# EAGLE design RedBot_Line_Sensor (EAGLE 6.6.0)
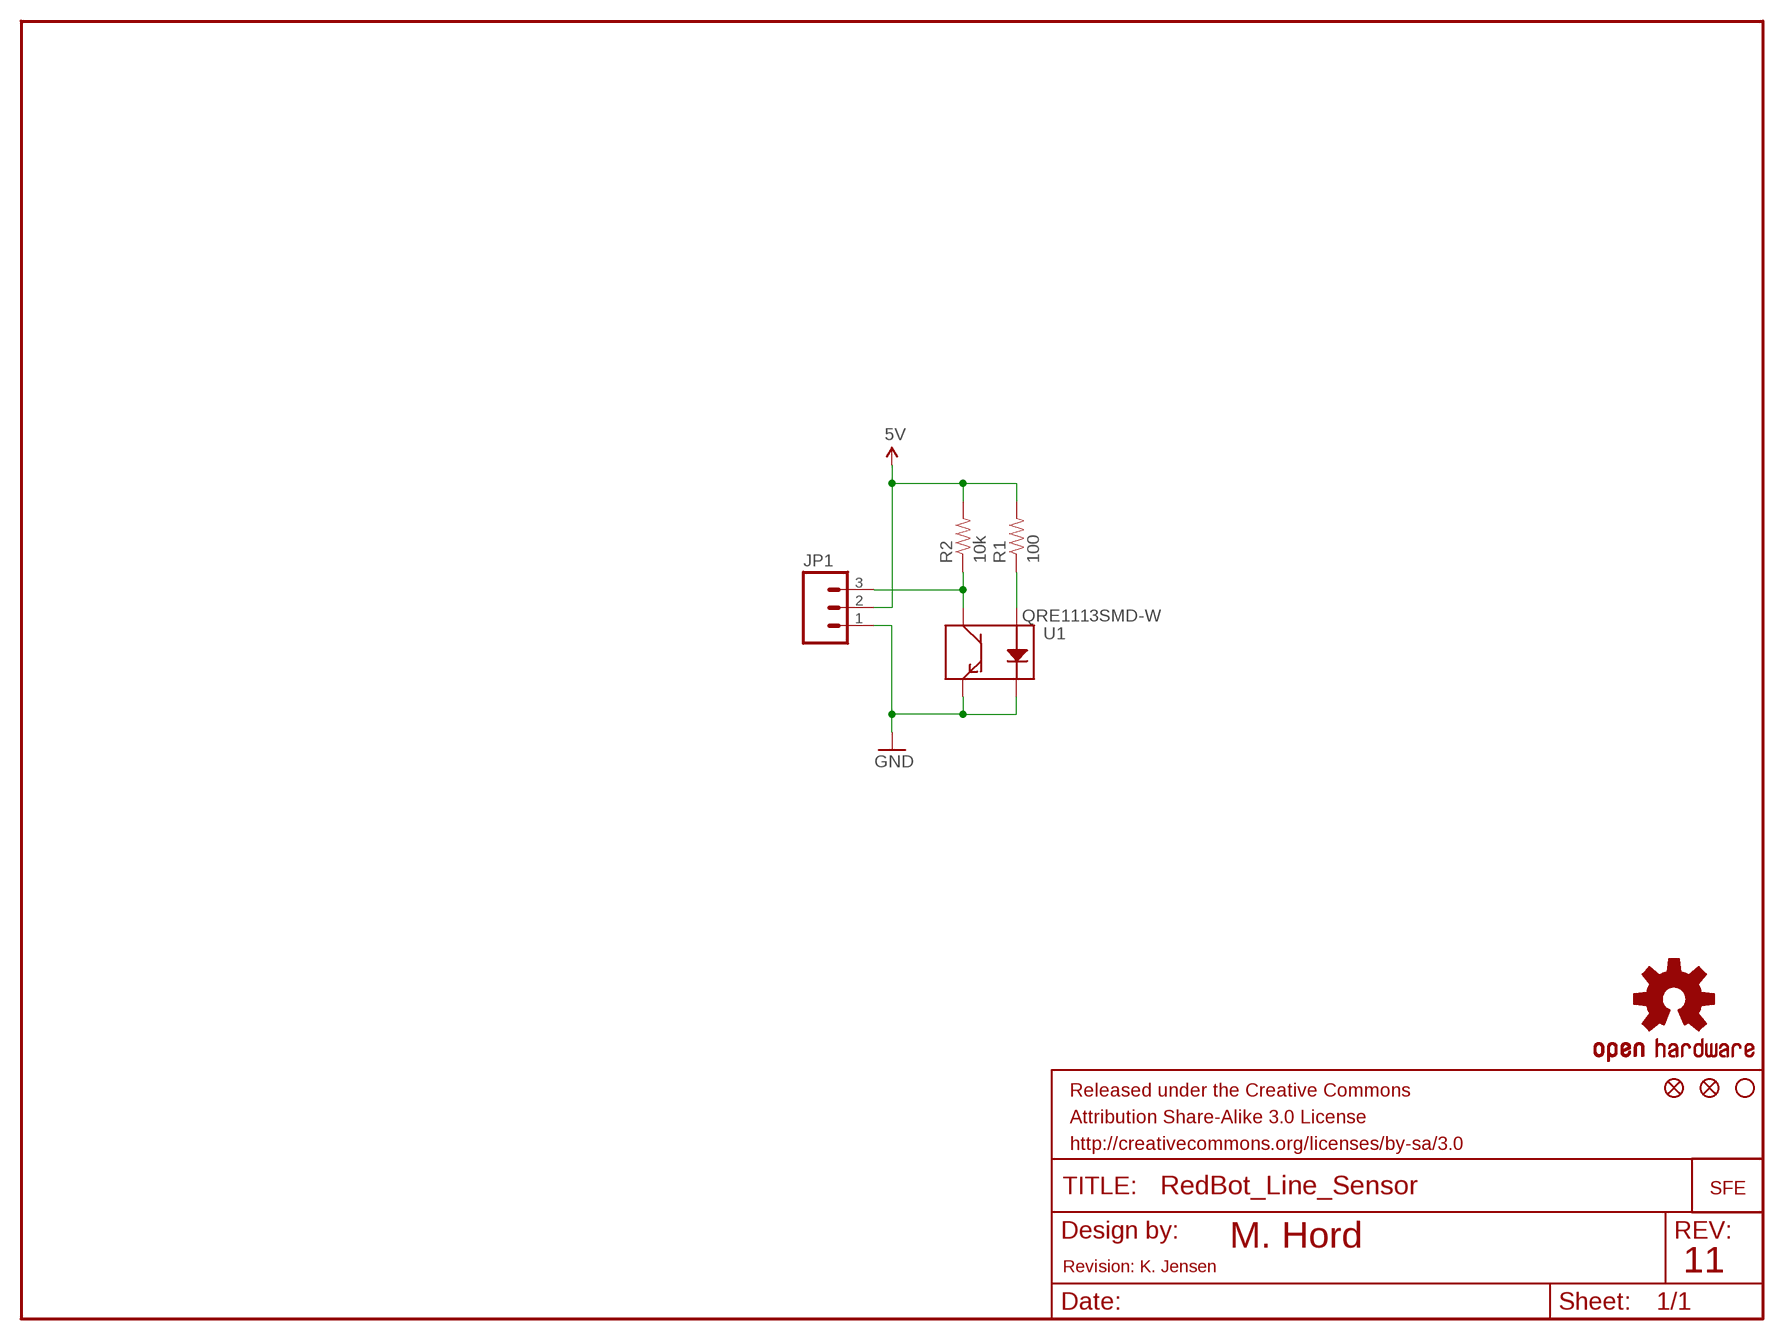
[diagram p0: schematic, sheet 1]

## Parts
FID1  FIDUCIAL1X2  [FIDUCIAL-1X2]
FID2  FIDUCIAL1X2  [FIDUCIAL-1X2]
FRAME1  FRAME-LETTER  [CREATIVE_COMMONS]
JP1  M031X03_SMD_RA_MALE_POST_SMALLER  [1X03_SMD_RA_MALE_POST_SMALLER]
LOGO2  OSHW-LOGOS  [OSHW-LOGO-S]
LOGO3  LOGO-SFESK  [SFE-LOGO-FLAME]
R1  100  100-1%  [0603-RES]
R2  10k  10KOHM1/10W1%(0603)0603  [0603-RES]
STANDOFF1  STAND-OFF  [STAND-OFF]
U1  QRE1113SMD-W  [QRE1113-W]

## Nets
5V: JP1.2 R1.2 R2.2
GND: JP1.1 U1.2(K) U1.4(E)
N$1: R1.1 U1.1(A)
N$2: JP1.3 R2.1 U1.3(C)

## Notes on the sheet
- M. Hord
- Revision: K. Jensen | 11

## Library data of the parts
FID1 FID2 = SparkFun-Aesthetics:FIDUCIAL: Fiducial Alignment Points Various fiducial points for machine vision alignment.
FRAME1 = SparkFun-Aesthetics:FRAME-LETTER: Schematic Frame Standard 8.5x11 US Letter frame
JP1 = SparkFun-Connectors:M03: Header 3 Standard 3-pin 0.1" header. Use with straight break away headers (SKU : PRT-00116), right angle break away headers (PRT-00553), swiss pins (PRT-00743), machine pins (PRT-00117), and female headers (PRT-00115). Molex polarized connector foot print use with SKU : PRT-08232 with associated crimp pins and housings.
LOGO2 = SparkFun-Aesthetics:OSHW-LOGO: Open Source Hardware Logo This logo indicates the piece of hardware it is found on incorporates a OSHW license and/or adheres to the definition of open source hardware found here: http://freedomdefined.org/OSHW
LOGO3 = SparkFun-Aesthetics:LOGO-SFE: Spark Fun Electronics PCB Logo This is the standard Spark Fun Electronics PCB logo.
R1 = SparkFun-Resistors:100-1%: 100-ohm SMT 1/10W - 1% (0603) RES-07863; PROD_ID: RES-07863
R2 = SparkFun-Resistors:10KOHM1/10W1%(0603): RES-00824; PROD_ID: RES-00824; VALUE: 10K
STANDOFF1 = SparkFun-Electromechanical:STAND-OFF: #4 Stand Off This is the mechanical footprint for a #4 phillips button head screw. Use the keepout ring to avoid running the screw head into surrounding components. SKU : PRT-00447
U1 = SparkFun-Sensors:QRE1113: Reflective object sensor

## Board
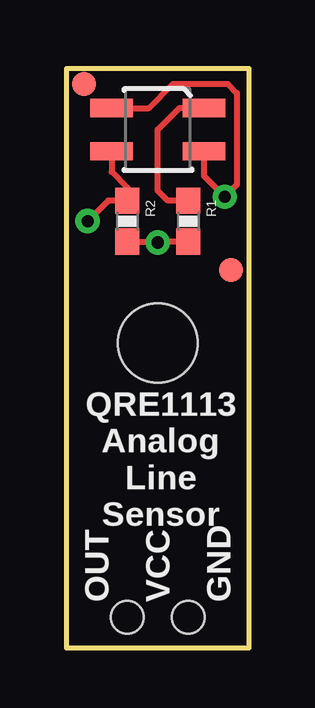
[diagram p1: board, top side]
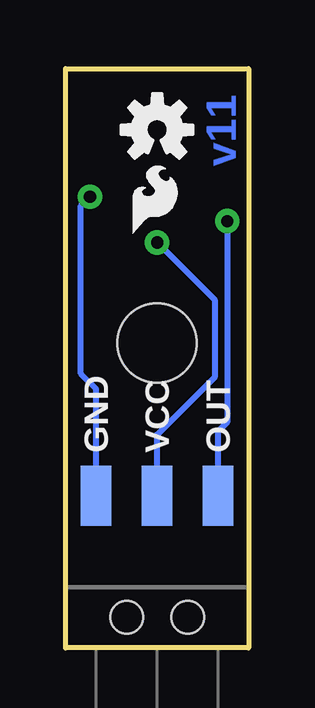
[diagram p2: board, bottom side, seen from below]

Size 7.62 x 24.13 mm. Coordinates in mm from the lower left corner, seen from the top.
Outline: 0,0 7.62,0 7.62,24.13 0,24.13 0,0
Copper layers (1*16): Top 0.035mm / dielectric 1.5mm / Bottom 0.035mm
Design rules "SparkFun-2-layer": minimum track width 7mil, minimum drill 15mil, track to track 8mil, track to pad 8mil, pad to pad 8mil, via to via 8mil, smd to smd 8mil, copper to edge 8mil, drill to drill 8mil, minimum pad ring 12mil, minimum via ring 10mil, stop-mask expansion 4mil, vias tented up to drill 20mil, thermal gap 10mil

### Footprints (pad centres in the part's own frame; a part is rotated, then mirrored left to right if it is on the bottom)
FIDUCIAL-1X2 = smd 1 x 1: 1 0,0
1X03_SMD_RA_MALE_POST_SMALLER = smd 1.27 x 2.5: 1 -2.54,5.07; 2 0,5.07; 3 2.54,5.07 | hole 1.359: -1.27,0; 1.27,0
0603-RES = smd 1.1 x 1: 1 -0.85,0; 2 0.85,0
STAND-OFF = hole 3.302: 0,0
QRE1113-W = smd 1.778 x 0.762: 1 -1.927,-0.9; 2 1.927,-0.9; 3 1.927,0.9; 4 -1.927,0.9

### Placement (x,y rotation side)
FID1  0.74,23.5 0 top
FID2  6.86,15.75 0 top
FRAME1  -25.4,-13.97 0 top  (outside the outline)
JP1  3.81,1.27 0 bottom
LOGO2  3.81,21.59 0 bottom
LOGO3  4.83,17.27 0 bottom
R1  5.08,17.78 270 top
R2  2.54,17.78 270 top
STANDOFF1  3.81,12.7 0 top
U1  3.81,21.59 180 top

### Tracks (layer width: path | path; a pad name or v marks a point on that pad's centre or on a via)
5V  (via drill 0.51)
  Top 0.254: R2.2 3.77,16.93 v3.81,16.89 3.85,16.93 R1.2
  Bottom 0.254: JP1.2 3.81,8.89 1.4,11.3 1.4,14.48 v3.81,16.89
GND  (via drill 0.51)
  Top 0.254: U1.2 3.44,22.49 4.45,23.5 6.73,23.5 7.11,23.11 7.11,19.3 v6.6,18.8 5.74,19.66 U1.4
  Bottom 0.254: JP1.1 6.35,10.79 6.99,11.43 6.99,18.41 v6.6,18.8
N$1
  Top 0.254: U1.1 4.71,22.49 3.81,21.59 3.81,19.05 4.23,18.63 R1.1
N$2  (via drill 0.51)
  Top 0.254: v0.89,17.78 1.74,18.63 R2.1 2.54,19.18 1.88,19.83 U1.3
  Bottom 0.254: JP1.3 1.27,9.02 0.89,9.4 v0.89,17.78

### Text on the board
Bottom: v11
tPlace: QRE1113 / Analog / Line / Sensor | OUT | VCC | GND
bPlace: OUT | VCC | GND
tNames: M.Hord